# EasyEDA Pro project Board.epro

# Schematic Schematic1
Board Name: Board1; Create Date: 2024-10-25; Page Name: P1; Project Name: New Project_2024-10-25_22-45-15; Schematic Name: Schematic1; Update Date: 2024-11-02; Company: 嘉立创EDA; Page Size: A4; Version: V1.0
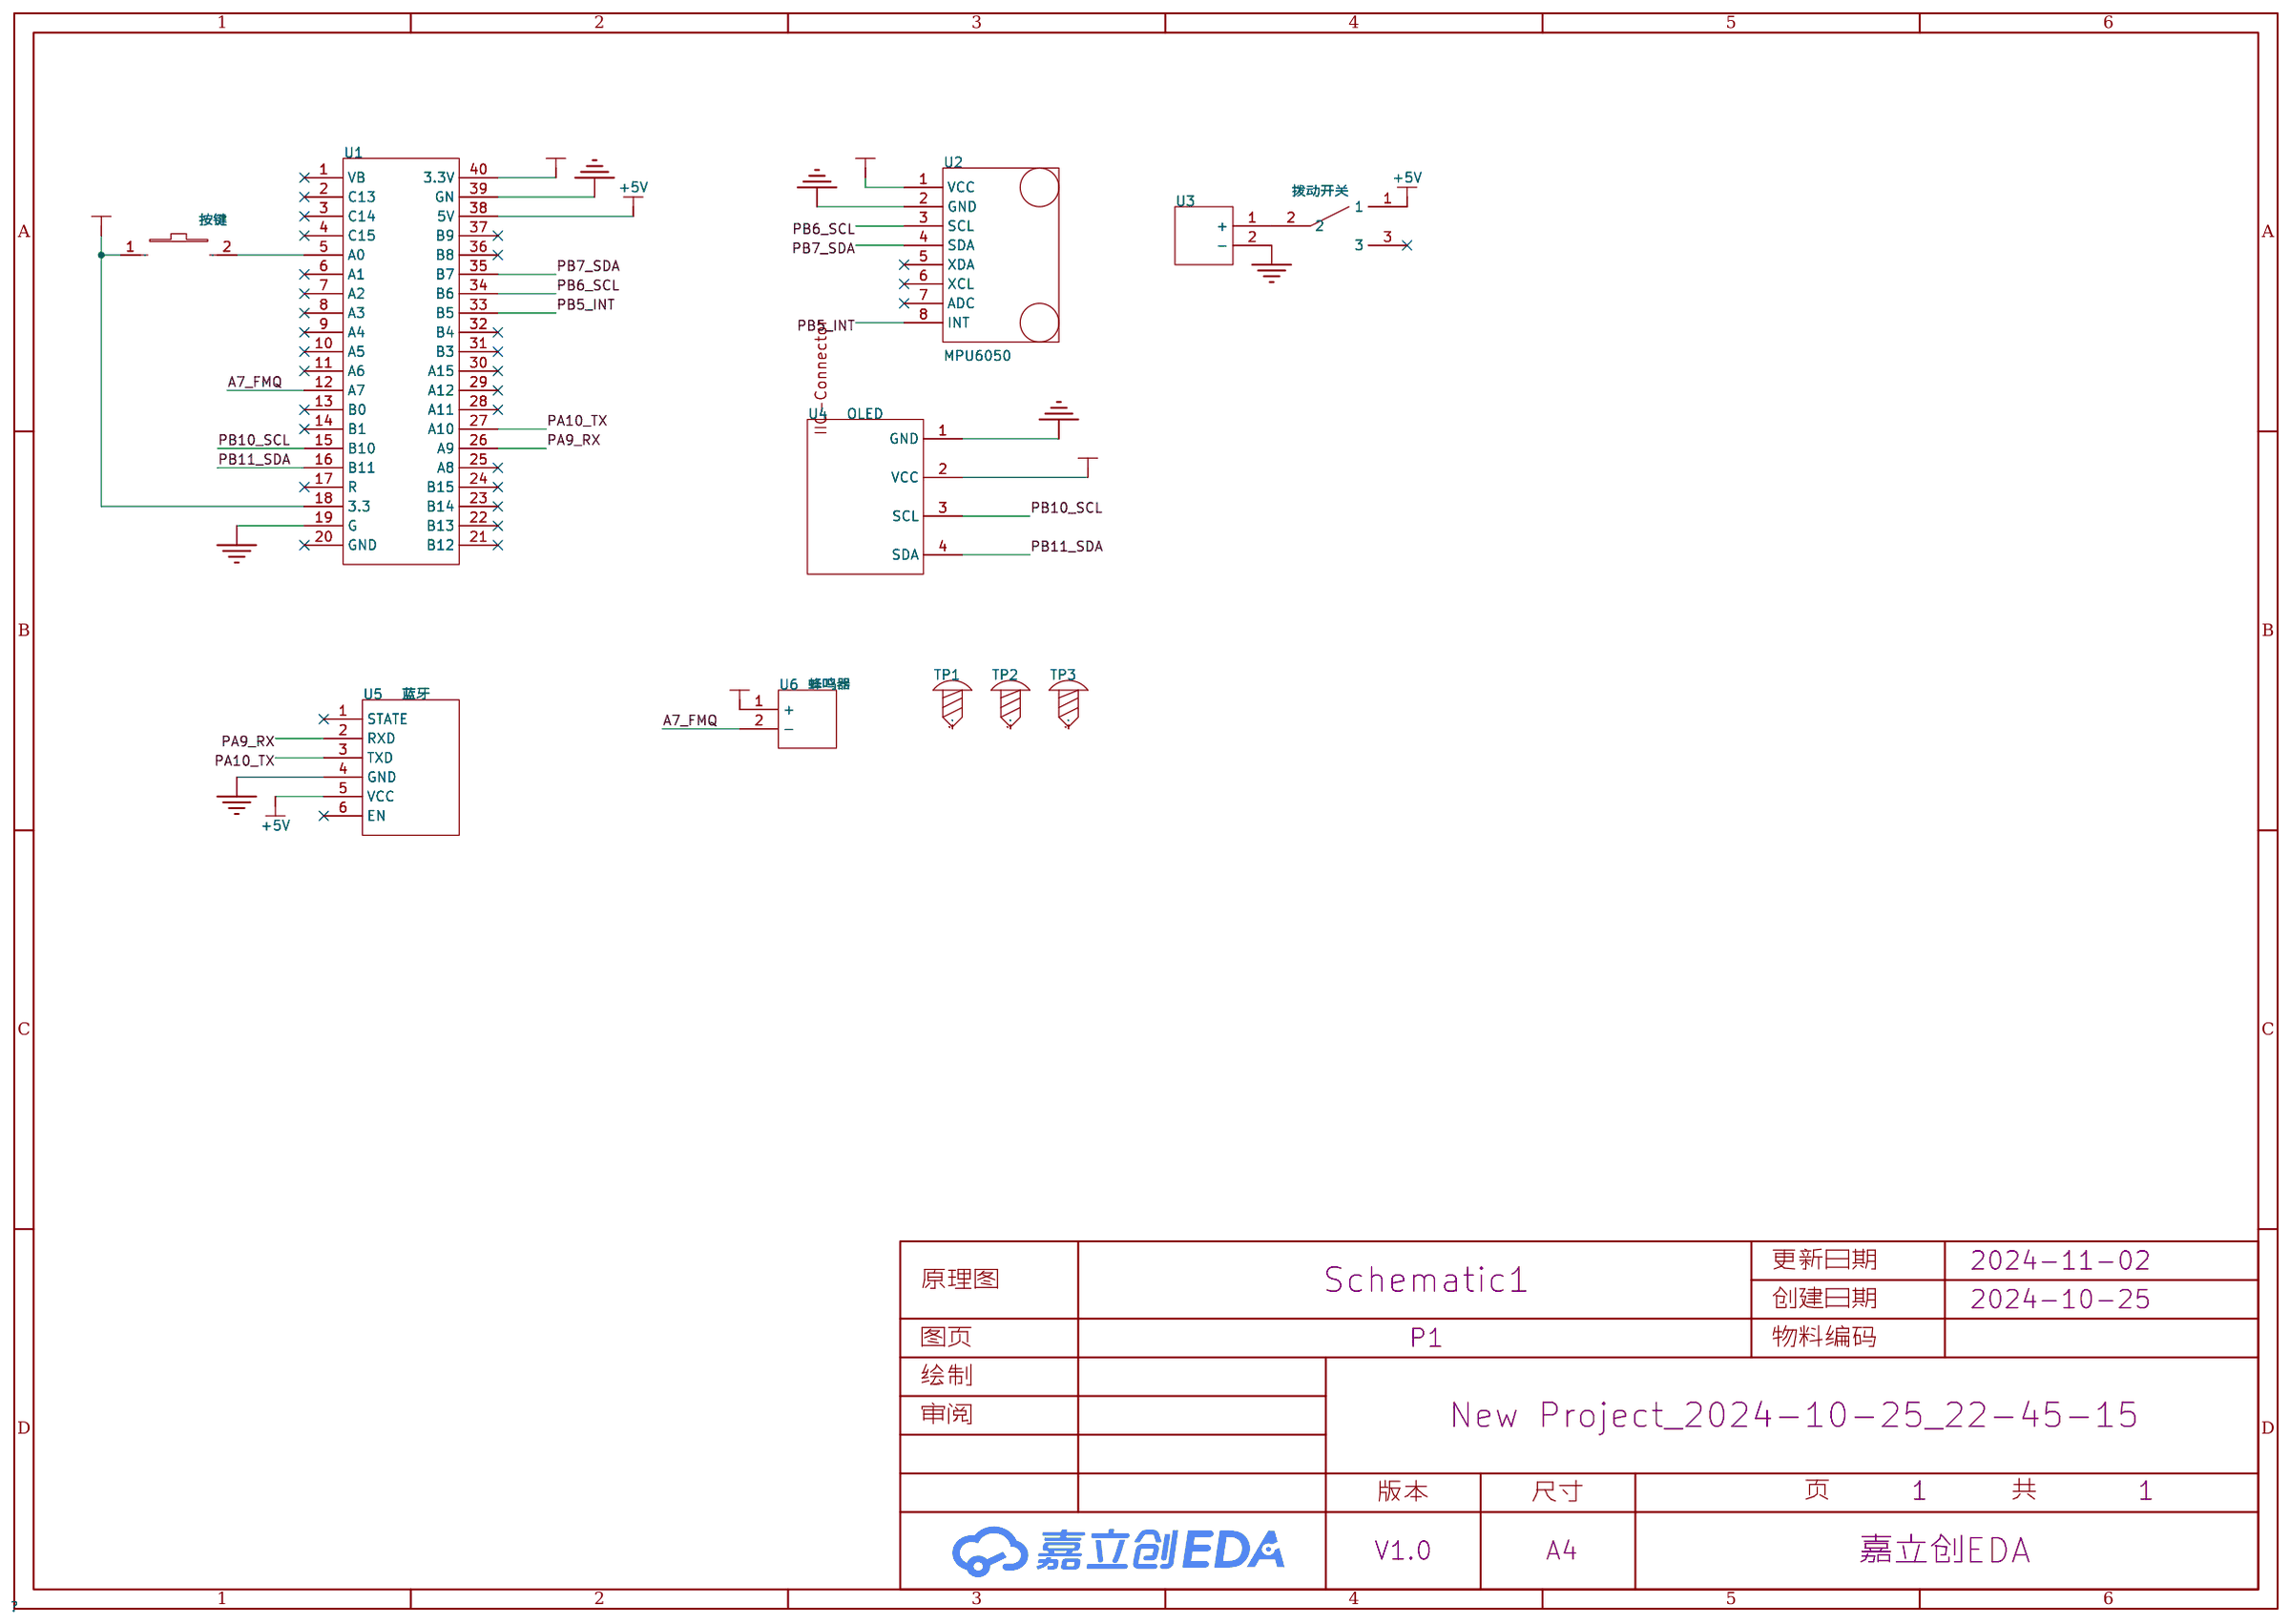
[diagram p0: schematic sheet]

## Parts
J1  按键  [SW-SMD_L6.0-W3.6-LS8.0]
J2  拨动开关  [SS12D00G4 1*3]
TP1  -  [M3螺丝]
TP2  -  [M3螺丝]
TP3  -  [M3螺丝]
U1  STM32  [STM32F103C8T6最小系统板]
U2  MPU6050  [MPU6050]
U3  -  [锂电池充电]
U4  OLED  [0.96OLED_4P]
U5  蓝牙  [蓝牙]
U6  蜂鸣器  [蜂鸣器]

## Library data of the parts
J1 = 按键: LCSC Part Name: 3x6x2.5 红头 耐高温; Supplier Part: C5382; Manufacturer Part: 轻触按键 3x6x2.5mm; Supplier Footprint: SMD; JLCPCB Part Class: 扩展库; Supplier: LCSC
J2 = 拨动开关
TP1-TP3 = 螺丝孔: Supplier Footprint: 插件
U1 = STM32: STM32F103C最小系统板
U2 = mpu6050
U3 = 锂电池
U4 = oled: LCSC Part Name: 0.96OLED_4P_MODULE_JX; Supplier Part: C9900004566; Manufacturer Part: 0.96OLED_4P_MODULE_JX; Supplier Footprint: 插件; JLCPCB Part Class: 扩展库; Supplier: LCSC
U5 = 蓝牙
U6 = 蜂鸣器

## Nets
3V3: J1.1 U1.18(3.3) U1.40(3.3V) U2.1(VCC) U4.2(VCC) U6.1(+)
+5V: J2.1 U1.38(5V) U5.5(VCC)
GND: U1.19(G) U1.39(GN) U2.2(GND) U3.2(-) U4.1(GND) U5.4(GND)
A7_FMQ: U1.12(A7) U6.2(-)
PA9_RX: U1.26(A9) U5.2(RXD)
PA10_TX: U1.27(A10) U5.3(TXD)
PB5_INT: U1.33(B5) U2.8(INT)
PB6_SCL: U1.34(B6) U2.3(SCL)
PB7_SDA: U1.35(B7) U2.4(SDA)
PB10_SCL: U1.15(B10) U4.3(SCL)
PB11_SDA: U1.16(B11) U4.4(SDA)
$1N921: J1.2 U1.5(A0)
$1N2730: J2.2 U3.1(+)

Not connected (* = marked no-connect by the designer): J2 3*; TP1 1; TP2 1; TP3 1; U1 1(VB)* 2(C13)* 3(C14)* 4(C15)* 6(A1)* 7(A2)* 8(A3)* 9(A4)* 10(A5)* 11(A6)* 13(B0)* 14(B1)* 17(R)* 20(GND)* 21(B12)* 22(B13)* 23(B14)* 24(B15)* 25(A8)* 28(A11)* 29(A12)* 30(A15)* 31(B3)* 32(B4)* 36(B8)* 37(B9)*; U2 5(XDA)* 6(XCL)* 7(ADC)*; U5 1(STATE)* 6(EN)*

# Board PCB1
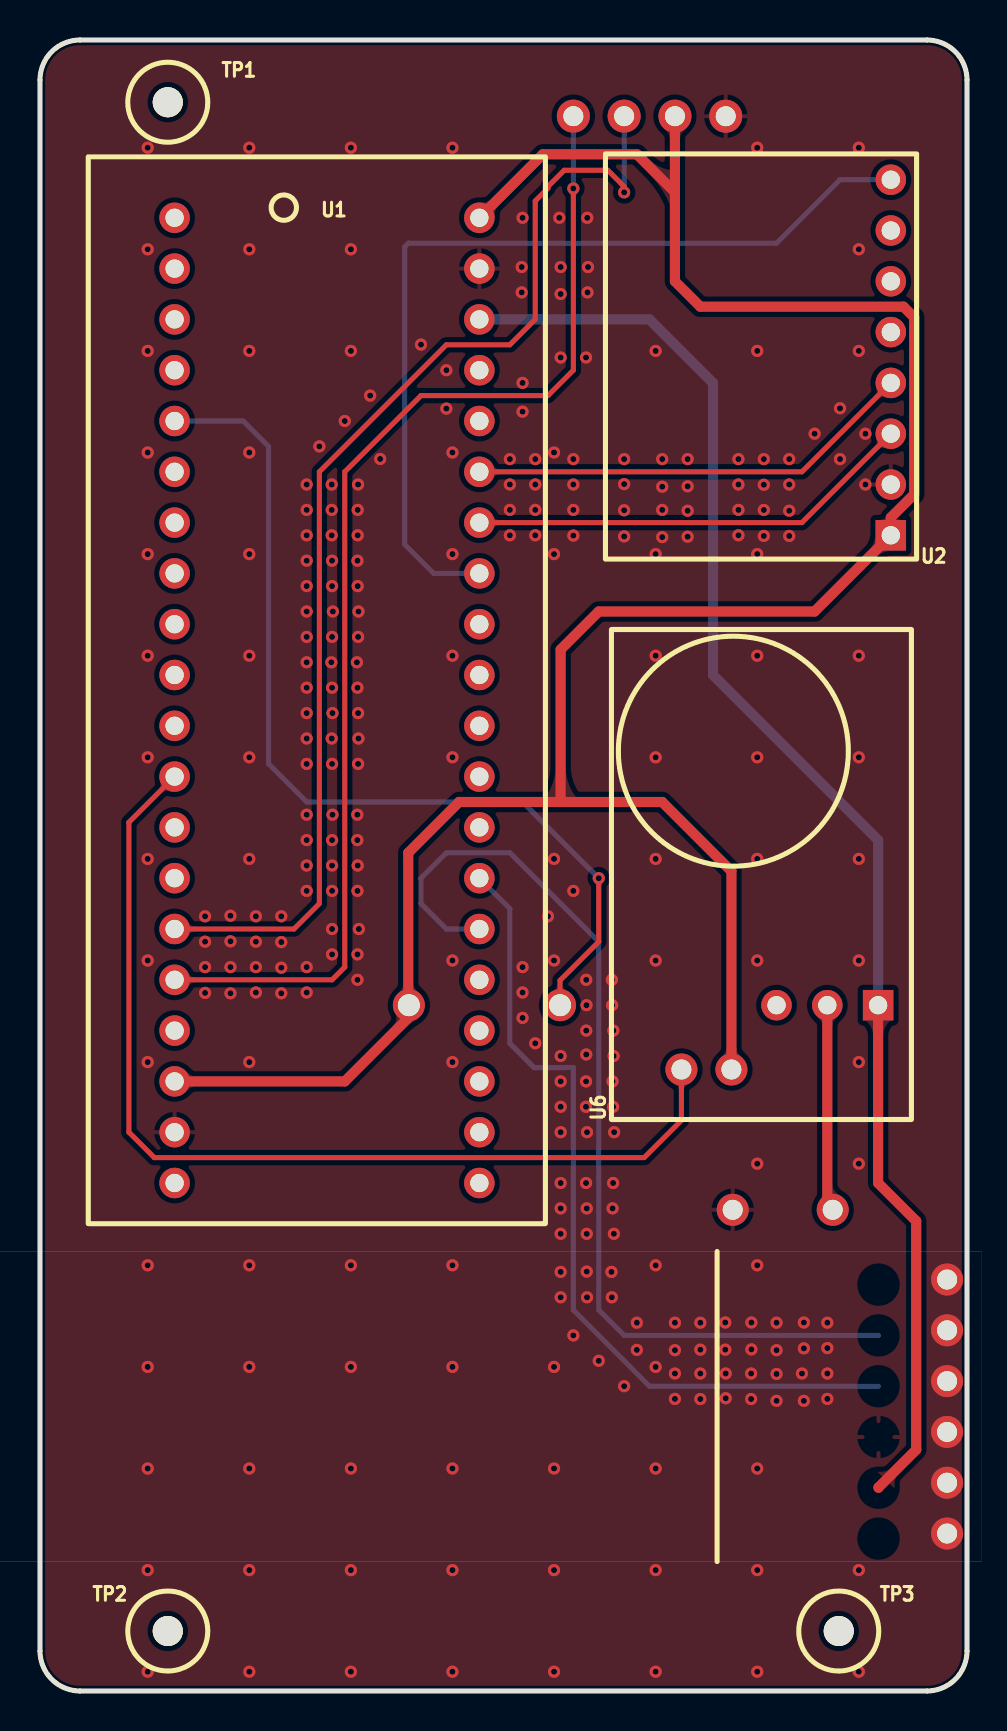
[diagram p1: board, top side]
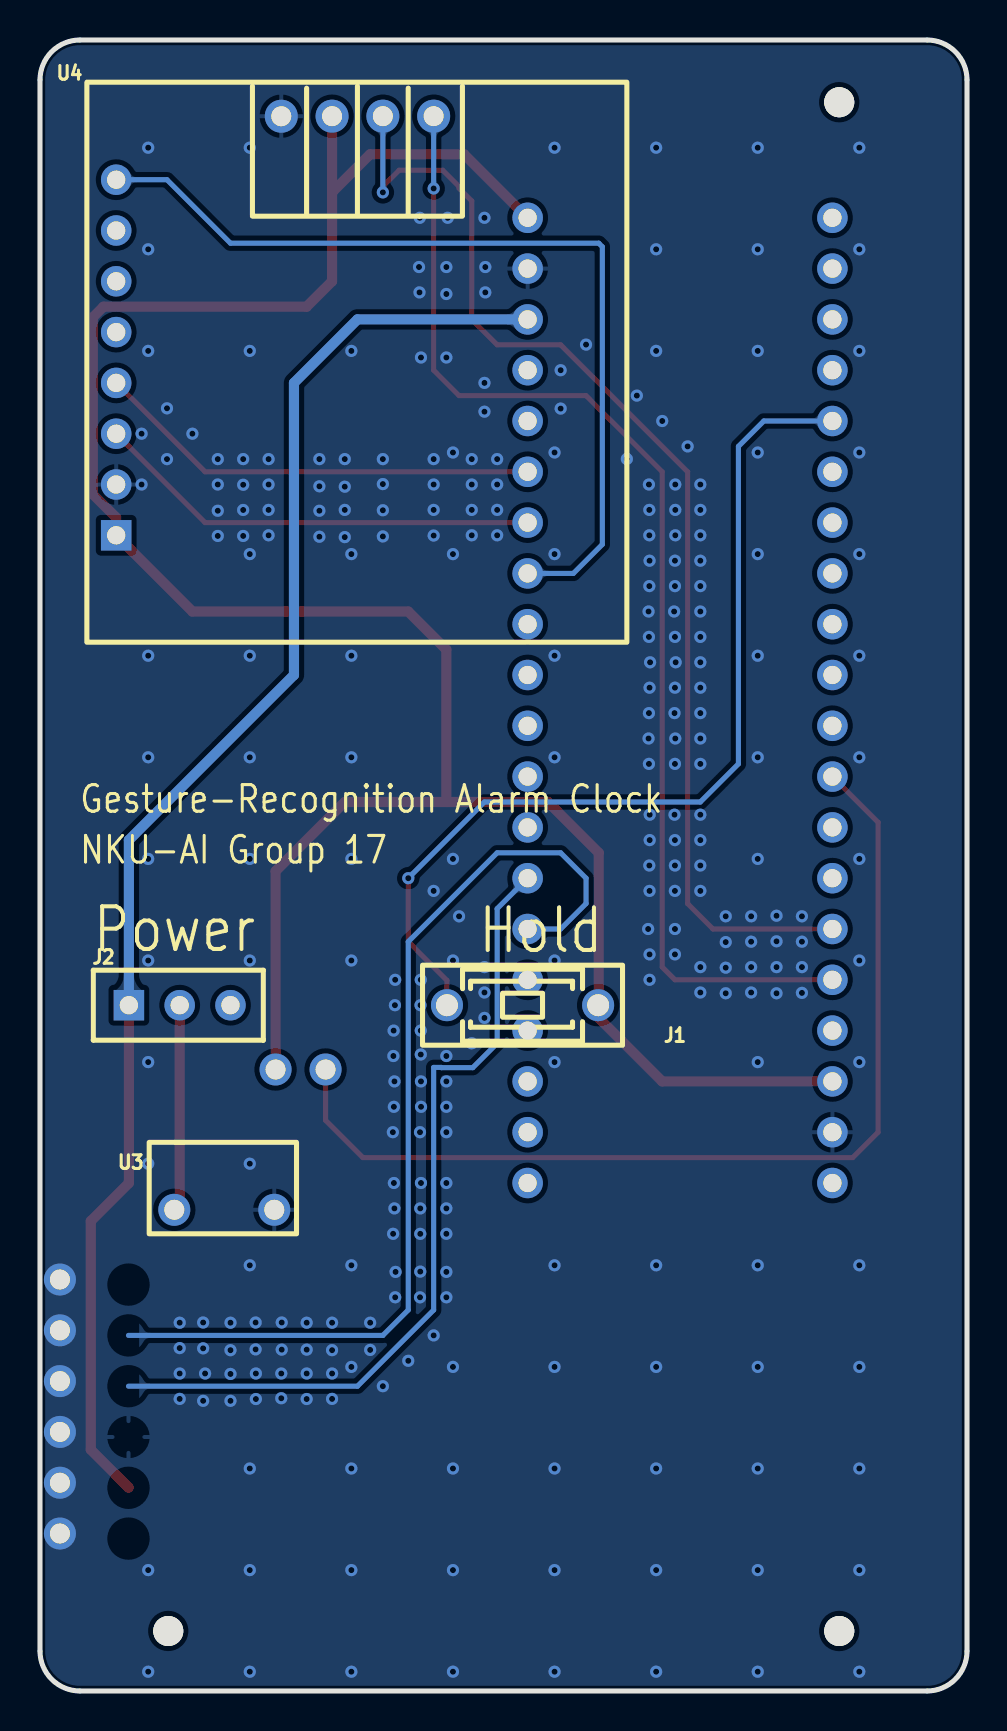
[diagram p2: board, bottom side, seen from below]

Outline 46.35 x 82.55 mm; copper layers: Top Layer, Bottom Layer. Coordinates in mm from the lower left corner of the outline.
Outline path: 0,80.55 0,2 arc(0.59,0.59) 2,0 44.35,0 arc(45.77,0.59) 46.35,2 46.35,80.55 arc(45.77,81.96) 44.35,82.55 2,82.55 arc(0.59,81.96) 0,80.55
Stack: Top Layer 0.035mm / Dielectric1 1.51mm FR4 er 4.5 / Bottom Layer 0.035mm

## Design rules (mm)
template: 自定义配置
spacing copperThickness1oz (default): track to track 0.102, other pairs 0.152 to 0.3
spacing copperThickness2oz: track to track 0.203, other pairs 0.152 to 0.3
track width copperThickness1oz (default): min 0.127, default 0.254, max 2.54
track width copperThickness2oz: min 0.203, default 0.254, max 2.54
track width power: min 0.127, default 0.508, max 2.54
differential pair differentialPair (default): width min 0.127, default 0.254, max 2.54; gap min 0.152, default 0.152
via viaSize (default): diameter min 0.5, default 0.61, max 10; hole min 0.3, default 0.305, max 6.299
net 3V3 uses power
net +5V uses power
net GND uses power

## Placement (name value [footprint] x y rotation side)
J1  按键  [SW-SMD_L6.0-W3.6-LS8.0]  22.22 34.29 0 bottom
J2  拨动开关  [SS12D00G4 1*3]  39.37 34.29 180 bottom
TP1  -  [M3螺丝]  6.45 79.38 0 top
TP2  -  [M3螺丝]  6.45 2.94 0 top
TP3  -  [M3螺丝]  40 2.94 0 top
U1  STM32  [STM32F103C8T6最小系统板]  14.6 45.72 0 top
U2  -  [MPU6050]  42.54 66.67 180 top
U3  -  [锂电池充电]  40.64 22.86 90 bottom
U4  OLED  [0.96OLED_4P]  30.48 78.74 180 bottom
U5  -  [蓝牙]  11.43 13.97 0 top
U6  -  [蜂鸣器]  28.57 28.58 90 top

## Footprints (pads in the part's own frame, mm; a bottom-side part is the same pattern mirrored in y, then rotated)
0.96OLED_4P
  round 1.65 hole 1: 1(-3.81,-0.002) 2(-1.27,0.002) 3(1.27,0.002) 4(3.81,0.002)
M3螺丝
  round 1.5 hole 3.2x1.5: 1(-0.064,0.064)
MPU6050
  rect 1.524x1.524 hole 0.914: 1(0,8.89)
  round 1.524 hole 0.914: 2(0,6.35) 3(0,3.81) 4(0,1.27) 5(0,-1.27) 6(0,-3.81) 7(0,-6.35) 8(0,-8.89)
SS12D00G4 1*3
  rect 1.524x1.524 hole 0.914: 1(-2.54,0)
  round 1.524 hole 0.914: 2(0,0) 3(2.54,0)
STM32F103C8T6最小系统板
  round 1.524 hole 0.914: 1(-7.874,27.94) 2(-7.874,25.4) 3(-7.874,22.86) 4(-7.874,20.32) 5(-7.874,17.78) 6(-7.874,15.24) 7(-7.874,12.7) 8(-7.874,10.16) 9(-7.874,7.62) 10(-7.874,5.08) 11(-7.874,2.54) 12(-7.874,0) 13(-7.874,-2.54) 14(-7.874,-5.08) 15(-7.874,-7.62) 16(-7.874,-10.16) 17(-7.874,-12.7) 18(-7.874,-15.24) 19(-7.874,-17.78) 20(-7.874,-20.32) 21(7.366,-20.32) 22(7.366,-17.78) 23(7.366,-15.24) 24(7.366,-12.7) 25(7.366,-10.16) 26(7.366,-7.62) 27(7.366,-5.08) 28(7.366,-2.54) 29(7.366,0) 30(7.366,2.54) 31(7.366,5.08) 32(7.366,7.62) 33(7.366,10.16) 34(7.366,12.7) 35(7.366,15.24) 36(7.366,17.78) 37(7.366,20.32) 38(7.366,22.86) 39(7.366,25.4) 40(7.366,27.94)
SW-SMD_L6.0-W3.6-LS8.0
  round 1.6 hole 1.1x1: 1(-3.78,0) 2(3.78,0)
蓝牙
  round 1.6 hole 1: 1(33.929,6.604) 2(33.929,4.064) 3(33.929,1.524) 4(33.929,-1.016) 5(33.929,-3.556) 6(33.929,-6.096)
蜂鸣器
  round 1.6 hole 1: 1(2.5,-6) 2(2.5,-3.5)
锂电池充电
  round 1.6 hole 1: 1(1.2,-1) 2(1.2,-6)

## Nets
As in the schematic.

Pads without a net: J2 3; TP1 1; TP2 1; TP3 1; U1 1 2 3 4 6 7 8 9 10 11 13 14 17 20 21 22 23 24 25 28 29 30 31 32 36 37; U2 5 6 7; U5 1 6

## Via types
v1: diameter 0.61, hole 0.305, Top Layer to Bottom Layer, 298 vias

## Routing (per net, layer and track width the routed paths; a pad name or vN(x,y) marks a point on that pad's centre or on a via; arc(x,y) is an arc through that point)
3V3: length 120.6
  Top Layer w0.508: 26,44.45 26.03,44.48 26.03,52.07 27.94,53.98 38.73,53.98 U2.1 42.54,58.67 43.71,59.84 43.71,68.68 43.18,69.22 33.02,69.22 31.75,70.48 31.75,74.93 ; 26,44.45 31.12,44.45 34.57,40.99 U6.1 ; 26,44.45 20.96,44.45 18.41,41.91 18.41,33.66 15.24,30.48 U1.18 ; 31.75,74.93 U4.2 ; 31.75,74.93 29.85,76.84 25.15,76.84 21.97,73.66
+5V: length 73.2
  Top Layer w0.508: 41.93,10.16 41.93,10.18 43.81,12.06 43.81,23.5 41.91,25.4 J2.1
  Bottom Layer w0.508: J2.1 41.91,42.55 33.66,50.8 33.66,65.41 30.48,68.58 21.97,68.58
GND:
  vias: v1(5.38,77.17) v1(5.38,72.09) v1(5.38,67.01) v1(5.38,61.92) v1(5.38,56.84) v1(5.38,51.77) v1(5.38,46.69) v1(5.38,41.61) v1(5.38,36.53) v1(5.38,31.45) v1(5.38,21.28) v1(5.38,16.21) v1(5.38,11.12) v1(5.38,6.05) v1(5.38,0.97) v1(8.25,38.73) v1(8.25,37.47) v1(8.25,36.2) v1(8.25,34.91) v1(9.53,38.76) v1(9.53,37.48) v1(9.53,36.2) v1(9.53,34.89) v1(10.47,77.17) v1(10.47,72.09) v1(10.47,67.01) v1(10.47,61.92) v1(10.47,56.84) v1(10.47,51.77) v1(10.47,46.69) v1(10.47,41.61) v1(10.47,31.45) v1(10.47,21.28) v1(10.47,16.21) v1(10.47,11.12) v1(10.47,6.05) v1(10.47,0.97) v1(10.79,38.73) v1(10.79,37.47) v1(10.79,36.2) v1(10.79,34.92) v1(12.06,38.73) v1(12.06,37.45) v1(12.06,36.17) v1(12.06,34.89) v1(13.34,60.33) v1(13.34,59.06) v1(13.34,57.78) v1(13.34,56.52) v1(13.34,55.25) v1(13.34,53.98) v1(13.34,52.7) v1(13.34,51.44) v1(13.34,50.17) v1(13.34,48.9) v1(13.34,47.62) v1(13.34,46.36) v1(13.34,43.81) v1(13.34,42.55) v1(13.34,41.28) v1(13.34,40.01) v1(13.34,36.2) v1(13.34,34.92) v1(13.97,62.23) v1(14.57,51.44) v1(14.59,60.33) v1(14.59,59.06) v1(14.59,57.78) v1(14.6,56.52) v1(14.6,55.25) v1(14.65,53.98) v1(14.6,52.7) v1(14.6,50.17) v1(14.63,48.9) v1(14.59,47.62) v1(14.6,46.36) v1(14.63,43.81) v1(14.61,42.55) v1(14.6,41.28) v1(14.61,40.01) v1(14.6,38.1) v1(14.6,36.83) v1(15.24,63.5) v1(15.54,77.17) v1(15.54,72.09) v1(15.54,67.01) v1(15.54,21.28) v1(15.54,16.21) v1(15.54,11.12) v1(15.54,6.05) v1(15.54,0.97) v1(15.85,51.44) v1(15.87,43.81) v1(15.87,42.55) v1(15.91,60.33) v1(15.89,59.06) v1(15.89,57.78) v1(15.88,56.52) v1(15.89,55.25) v1(15.93,53.98) v1(15.91,52.7) v1(15.88,50.17) v1(15.91,48.9) v1(15.93,47.62) v1(15.91,46.36) v1(15.89,41.28) v1(15.88,40.01) v1(15.94,38.1) v1(15.88,36.83) v1(15.88,35.56) v1(16.51,64.77) v1(17.01,61.6) v1(19.05,67.32) v1(20.32,66.04) v1(20.32,64.12) v1(20.62,77.17) v1(20.62,61.92) v1(20.62,56.84) v1(20.62,51.77) v1(20.62,46.69) v1(20.62,36.53) v1(20.62,31.45) v1(20.62,21.28) v1(20.62,16.21) v1(20.62,11.12) v1(20.62,6.05) v1(20.62,0.97) v1(23.5,61.59) v1(23.5,60.33) v1(23.5,59.06) v1(23.5,57.78) v1(24.13,73.66) v1(24.09,71.2) v1(24.09,69.93) v1(24.13,65.41) v1(24.13,63.97) v1(24.13,36.2) v1(24.13,34.92) v1(24.13,33.66) v1(24.76,61.59) v1(24.76,60.33) v1(24.76,59.06) v1(24.76,57.78) v1(24.76,32.39) v1(25.4,38.73) v1(25.71,61.92) v1(25.71,56.84) v1(25.71,41.61) v1(25.71,36.53) v1(25.71,16.21) v1(25.71,11.12) v1(25.71,6.05) v1(25.71,0.97) v1(25.97,73.66) v1(26.03,71.2) v1(26.03,69.85) v1(26.03,66.67) v1(26.03,31.75) v1(26.03,30.48) v1(26.03,29.21) v1(26.03,27.94) v1(26.03,25.4) v1(26.03,24.13) v1(26.03,22.86) v1(26.03,20.96) v1(26.03,19.69) v1(26.67,61.59) v1(26.67,60.33) v1(26.67,59.06) v1(26.67,57.77) v1(26.67,40.01) v1(26.67,17.78) v1(27.36,73.66) v1(27.31,66.67) v1(27.31,35.56) v1(27.33,34.29) v1(27.31,33.02) v1(27.31,31.83) v1(27.31,30.48) v1(27.3,29.21) v1(27.35,27.94) v1(27.31,25.4) v1(27.34,24.13) v1(27.34,22.86) v1(27.34,20.97) v1(27.35,19.69) v1(27.4,71.2) v1(27.38,69.93) v1(27.94,16.51) v1(28.59,35.56) v1(28.61,34.29) v1(28.63,30.48) v1(28.66,29.21) v1(28.66,25.4) v1(28.63,24.13) v1(28.57,20.96) v1(28.59,19.69) v1(28.67,33.02) v1(28.68,31.75) v1(28.71,27.94) v1(28.7,22.86) v1(29.21,61.59) v1(29.21,60.35) v1(29.21,59.04) v1(29.21,57.73) v1(29.21,15.24) v1(29.84,18.41) v1(29.84,17.05) v1(30.78,67.01) v1(30.78,56.84) v1(30.78,51.77) v1(30.78,46.69) v1(30.78,41.61) v1(30.78,36.53) v1(30.78,21.28) v1(30.78,16.21) v1(30.78,11.12) v1(30.78,6.05) v1(30.78,0.97) v1(31.12,61.59) v1(31.12,60.22) v1(31.12,59.06) v1(31.12,57.69) v1(31.75,18.41) v1(31.75,17.04) v1(31.75,15.88) v1(31.75,14.6) v1(32.38,61.59) v1(32.38,60.23) v1(32.38,59.01) v1(32.38,57.71) v1(33.02,18.41) v1(33.02,17.07) v1(33.02,15.88) v1(33.02,14.6) v1(34.27,18.42) v1(34.27,17.07) v1(34.29,15.88) v1(34.29,14.64) v1(34.93,61.59) v1(34.93,60.33) v1(34.93,59.06) v1(34.93,57.78) v1(35.56,15.88) v1(35.56,14.6) v1(35.57,18.42) v1(35.57,17.08) v1(35.87,77.17) v1(35.87,67.01) v1(35.87,56.84) v1(35.87,51.77) v1(35.87,46.69) v1(35.87,41.61) v1(35.87,36.53) v1(35.87,26.37) v1(35.87,21.28) v1(35.87,11.12) v1(35.87,6.05) v1(35.87,0.97) v1(36.19,61.59) v1(36.19,60.31) v1(36.19,59.05) v1(36.19,57.75) v1(36.83,18.41) v1(36.83,17.04) v1(36.83,15.85) v1(36.83,14.51) v1(37.47,61.59) v1(37.47,60.33) v1(37.47,59.01) v1(37.47,57.75) v1(38.1,15.88) v1(38.2,18.42) v1(38.2,17.13) v1(38.2,14.51) v1(38.73,62.87) v1(39.37,18.41) v1(39.37,17.15) v1(39.37,15.88) v1(39.37,14.6) v1(40,64.14) v1(40,61.59) v1(40.94,77.17) v1(40.94,72.09) v1(40.94,67.01) v1(40.94,51.77) v1(40.94,46.69) v1(40.94,41.61) v1(40.94,36.53) v1(40.94,31.45) v1(40.94,26.37) v1(40.94,6.05) v1(40.94,0.97) v1(41.28,62.87) v1(41.28,60.33)
A7_FMQ: length 50.2
  Top Layer w0.254: U6.2 32.07,28.53 30.21,26.67 5.72,26.67 4.44,27.94 4.44,43.43 U1.12
PA9_RX: length 48.9
  Bottom Layer w0.254: 41.93,17.78 29.21,17.78 27.94,19.05 27.94,37.47 23.5,41.91 20.32,41.91 19.05,40.64 19.05,39.37 20.32,38.1 21.97,38.1
PA10_TX: length 41.5
  Bottom Layer w0.254: 21.97,40.64 23.5,39.12 23.5,32.39 24.71,31.17 26.28,31.17 26.29,31.18 26.67,31.18 26.67,19.05 30.48,15.24 41.93,15.24
PB5_INT: length 44.9
  Bottom Layer w0.254: U2.8 40,75.56 36.83,72.39 18.41,72.39 18.24,72.21 18.24,57.33 19.69,55.88 21.97,55.88
PB6_SCL: length 22.4
  Top Layer w0.254: 21.97,58.42 38.1,58.42 U2.3
PB7_SDA: length 22.4
  Top Layer w0.254: U2.4 38.1,60.96 21.97,60.96
PB10_SCL: length 58.8
  Top Layer w0.254: 6.73,38.1 12.7,38.1 13.97,39.37 13.97,60.96 20.32,67.31 23.5,67.31 24.76,68.58 24.76,74.5 25.4,75.14 25.4,75.22 26.21,76.04 28.4,76.04 29.21,75.22 v1(29.21,74.93)
  Bottom Layer w0.254: U4.3 v1(29.21,74.93)
PB11_SDA: length 59.6
  Top Layer w0.254: U1.16 14.6,35.56 15.24,36.2 15.24,60.96 19.05,64.77 25.4,64.77 26.67,66.04 26.67,74.93
  Bottom Layer w0.254: v1(26.67,75.13) U4.4
$1N921: length 47.1
  Top Layer w0.254: J1.2 26,35.53 27.94,37.47 v1(27.94,40.64)
  Bottom Layer w0.254: v1(27.94,40.64) 24.13,44.45 13.34,44.45 11.43,46.36 11.43,62.23 10.16,63.5 U1.5
$1N2730: length 10.3
  Top Layer w0.508: J2.2 39.37,24.33 U3.1

## Copper pours and planes (outline as drawn; the poured copper is in the pictures)
GND on Top Layer: -0.25,82.55 48.26,82.55 48.26,-0.63 -0.25,-0.63
GND on Bottom Layer: -0.64,83.82 47.62,83.82 47.62,-0.63 -0.64,-0.63

Small or netless copper shapes (teardrops, artwork), in the pictures only: 26 on Top Layer, 14 on Bottom Layer

## Text on the board
Bottom Silkscreen Layer: Gesture-Recognition Alarm Clock | NKU-AI Group 17 | Hold | Power
